# EAGLE design v2.1 (EAGLE 9.6.2)
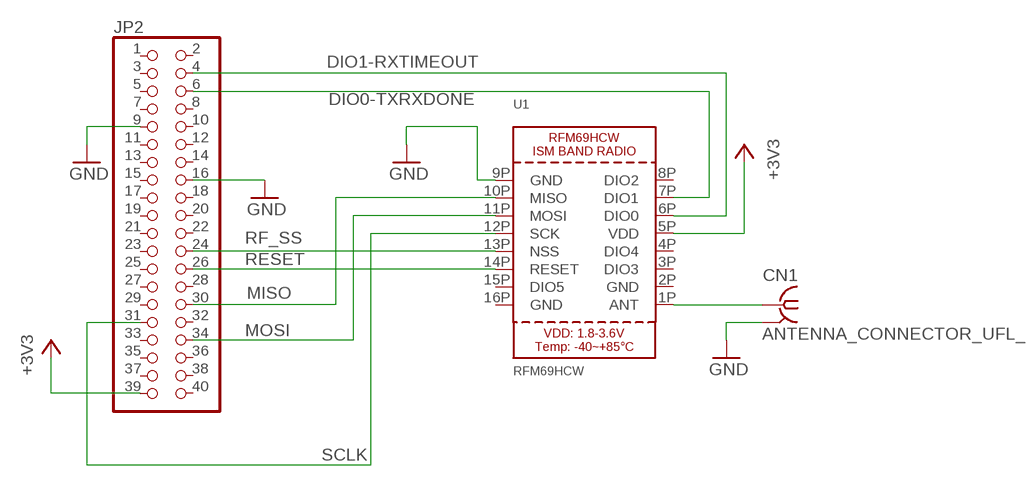
[diagram p0: schematic, sheet 1]

## Parts
CN1  ANTENNA_CONNECTOR_UFL_SMA  [ANTENNA_CONNECTOR_UFL_SMA]
JP2  PINHD-2X20  [2X20]
U1  RFM69HCW  RFM69HCW_SMT  [RFMHCW_SMT]

## Nets
+3V3: JP2.39 U1.5P(VDD)
DIO0-TXRXDONE: JP2.6 U1.7P(DIO1)
DIO1-RXTIMEOUT: JP2.4 U1.6P(DIO0)
GND: CN1.GND CN1.GND@1(GND) CN1.GND@2(GND) CN1.GND@3(GND) JP2.9 JP2.16 U1.9P(GND)
MISO: JP2.30 U1.10P(MISO)
MOSI: JP2.34 U1.11P(MOSI)
N$1: CN1.SIGNAL U1.1P(ANT)
RESET: JP2.26 U1.14P(RESET)
RF_SS: JP2.24 U1.13P(NSS)
SCLK: JP2.31 U1.12P(SCK)
Unconnected: JP2.1 JP2.2 JP2.3 JP2.5 JP2.7 JP2.8 JP2.10 JP2.11 JP2.12 JP2.13 JP2.14 JP2.15 JP2.17 JP2.18 JP2.19 JP2.20 JP2.21 JP2.22 JP2.23 JP2.25 JP2.27 JP2.28 JP2.29 JP2.32 JP2.33 JP2.35 JP2.36 JP2.37 JP2.38 JP2.40 U1.3P(DIO3) U1.4P(DIO4) U1.8P(DIO2) U1.15P(DIO5)

## Power pins joined to a net without a drawn wire
GND: U1.2P(GND) U1.16P(GND)

## Library data of the parts
CN1 = antenna_connector_ufl_sma:ANTENNA_CONNECTOR_UFL_SMA
JP2 = pinhead:PINHD-2X20: PIN HEADER
U1 = microbuilder:RFM69HCW: RFM69HCW - ISM Band RF Transceiver

## Board
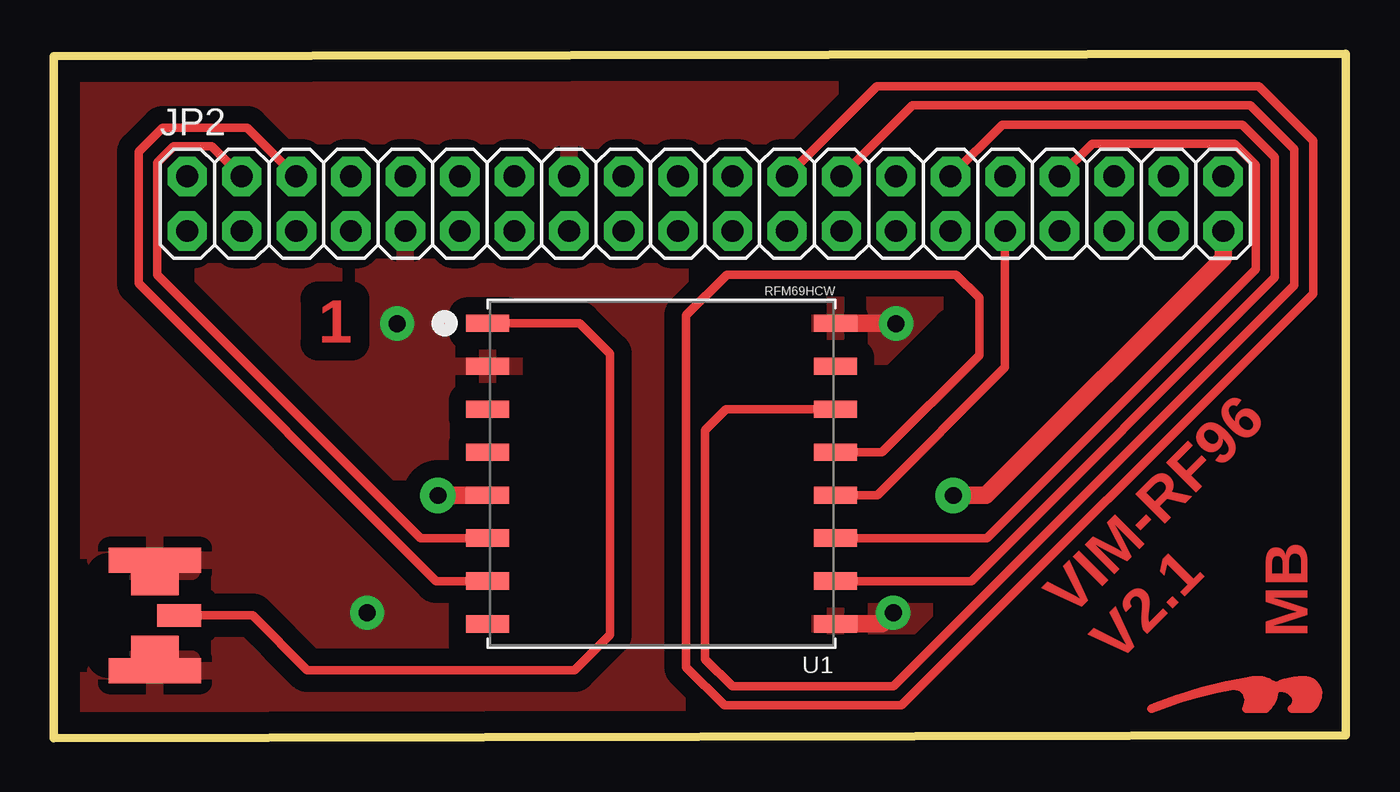
[diagram p1: board, top side]
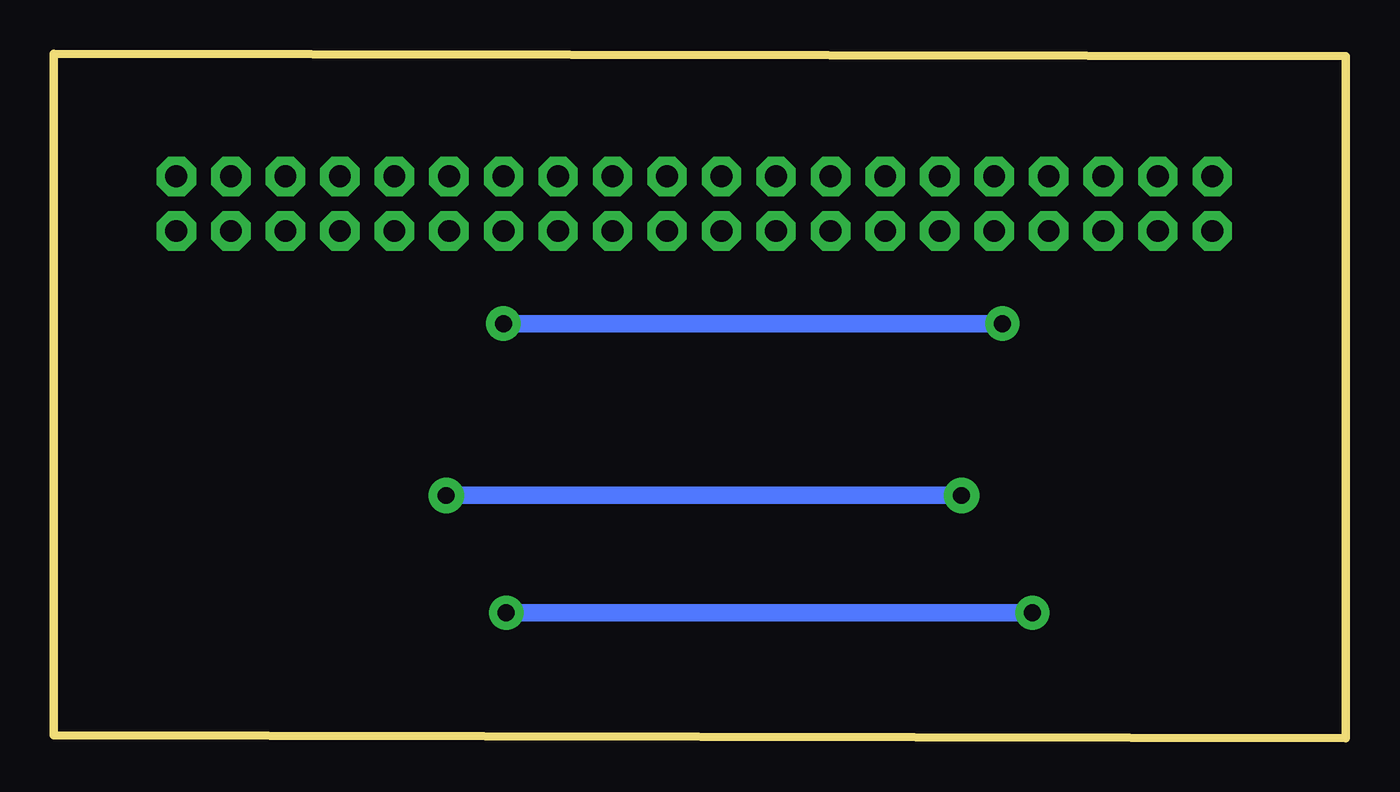
[diagram p2: board, bottom side, seen from below]

Size 60.2 x 31.88 mm. Coordinates in mm from the lower left corner, seen from the top.
Outline: 0,0 60.2,0.13 60.2,31.88 0,31.75 0,0
Copper layers (1*16): Top 0.035mm / dielectric 1.5mm / Bottom 0.035mm
Design rules "htl-klu *": minimum track width 16mil, minimum drill 31mil, track to track 16mil, track to pad 16mil, pad to pad 16mil, via to via 16mil, smd to smd 12mil, copper to edge 40mil, drill to drill 16mil, minimum pad ring 16mil, minimum via ring 16mil, stop-mask expansion 4mil, vias tented up to drill 0mil, thermal gap 20mil
tRestrict: 6 lines

### Footprints (pad centres in the part's own frame; a part is rotated, then mirrored left to right if it is on the bottom)
ANTENNA_CONNECTOR_UFL_SMA = smd 2.2 x 2.2: GND -2.05,1.125; GND@2 2.05,1.125 | smd 1.15 x 4.3: GND@1 -2.575,1.125; GND@3 2.575,1.125 | smd 1.05 x 2.05: SIGNAL 0,0
2X20 = drill 1.016 octagon: 1 -24.13,-1.27; 2 -24.13,1.27; 3 -21.59,-1.27; 4 -21.59,1.27; 5 -19.05,-1.27; 6 -19.05,1.27; 7 -16.51,-1.27; 8 -16.51,1.27; 9 -13.97,-1.27; 10 -13.97,1.27; 11 -11.43,-1.27; 12 -11.43,1.27; 13 -8.89,-1.27; 14 -8.89,1.27; 15 -6.35,-1.27; 16 -6.35,1.27; 17 -3.81,-1.27; 18 -3.81,1.27; 19 -1.27,-1.27; 20 -1.27,1.27; 21 1.27,-1.27; 22 1.27,1.27; 23 3.81,-1.27; 24 3.81,1.27; 25 6.35,-1.27; 26 6.35,1.27; 27 8.89,-1.27; 28 8.89,1.27; 29 11.43,-1.27; 30 11.43,1.27; 31 13.97,-1.27; 32 13.97,1.27; 33 16.51,-1.27; 34 16.51,1.27; 35 19.05,-1.27; 36 19.05,1.27; 37 21.59,-1.27; 38 21.59,1.27; 39 24.13,-1.27; 40 24.13,1.27
RFMHCW_SMT = smd 2 x 0.8: 1P 8.1,-7; 2P 8.1,-5; 3P 8.1,-3; 4P 8.1,-1; 5P 8.1,1; 6P 8.1,3; 7P 8.1,5; 8P 8.1,7; 9P -8.1,7; 10P -8.1,5; 11P -8.1,3; 12P -8.1,1; 13P -8.1,-1; 14P -8.1,-3; 15P -8.1,-5; 16P -8.1,-7

### Placement (x,y rotation side)
CN1  5.84,5.71 90 top
JP2  30.35,24.89 0 top
U1  28.32,12.32 180 top
U$1  [LOGOTOP_8]  56.39,1.4 0 top

### Tracks (layer width: path | path; a pad name or v marks a point on that pad's centre or on a via)
+3V3  (via drill 0.79 pad 1.65)
  Top 0.406: 17.92,11.32 v17.91,11.3
  Top 0.813: U1.5P 17.92,11.32 | v41.91,11.3 43.43,11.3 54.48,22.35 JP2.39
  Bottom 0.813: v17.91,11.3 v41.91,11.3
DIO0-TXRXDONE
  Top 0.406: JP2.6 11.28,26.16 9.02,28.42 5.08,28.42 3.96,27.3 3.96,21.18 17.83,7.32 U1.7P
DIO1-RXTIMEOUT
  Top 0.406: JP2.4 7.37,27.56 5.59,27.56 4.83,26.8 4.83,21.59 17.1,9.32 U1.6P
GND  (via drill 0.79)
  Top 0.406: 39.23,19.32 v39.24,19.3
  Top 0.813: U1.16P 39.23,19.32 | U1.9P 38.59,5.32 v39.12,5.84
  Bottom 0.813: v39.24,19.3 v16,19.3 | v39.12,5.84 v14.61,5.84
  pour Top (isolate 0.813): -1.4,-1.27 -1.4,33.02 61.47,33.02 61.47,-1.27
MISO
  Top 0.406: JP2.30 44.2,28.57 55.37,28.57 56.9,27.05 56.9,21.46 42.75,7.32 U1.10P
MOSI
  Top 0.406: JP2.34 48.39,27.69 54.99,27.69 56.01,26.67 56.01,21.84 43.48,9.32 U1.11P
N$1
  Top 0.406: U1.1P 24.5,19.32 25.91,17.91 25.91,4.83 24.26,3.17 11.81,3.17 9.27,5.71 CN1.SIGNAL
RESET
  Top 0.406: JP2.26 40.01,29.46 55.75,29.46 57.78,27.43 57.78,21.08 39.12,2.41 31.62,2.41 30.35,3.68 30.35,14.35 31.32,15.32 U1.14P
RF_SS
  Top 0.406: U1.13P 38.59,13.32 43.12,17.84 43.12,20.51 42.04,21.59 31.37,21.59 29.46,19.68 29.46,3.3 31.24,1.52 39.5,1.52 58.67,20.7 58.67,27.81 56.13,30.35 38.35,30.35 JP2.24
SCLK
  Top 0.406: JP2.31 44.32,17.27 38.37,11.32 U1.12P

### Text on the board
Top: 1 | MB | VIM-RF96 / V2.1